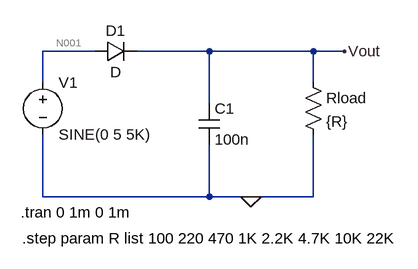
[diagram p0: schematic rectificador de media ona.asc]
rectificador de media ona.asc, the LTspice schematic file:
Version 4
SHEET 1 880 680
WIRE 176 64 96 64
WIRE 352 64 240 64
WIRE 512 64 352 64
WIRE 560 64 512 64
WIRE 96 112 96 64
WIRE 512 112 512 64
WIRE 352 144 352 64
WIRE 96 288 96 192
WIRE 352 288 352 208
WIRE 352 288 96 288
WIRE 416 288 352 288
WIRE 512 288 512 192
WIRE 512 288 416 288
FLAG 416 288 0
FLAG 560 64 Vout
SYMBOL voltage 96 96 R0
WINDOW 123 0 0 Left 0
WINDOW 39 0 0 Left 0
SYMATTR InstName V1
SYMATTR Value SINE(0 5 5K)
SYMBOL diode 176 80 R270
WINDOW 0 32 32 VTop 2
WINDOW 3 0 32 VBottom 2
SYMATTR InstName D1
SYMBOL cap 336 144 R0
SYMATTR InstName C1
SYMATTR Value 100n
SYMBOL res 496 96 R0
SYMATTR InstName Rload
SYMATTR Value {R}
TEXT 62 312 Left 2 !.tran 0 1m 0 1m
TEXT 64 352 Left 2 !.step param R list 100 220 470 1K 2.2K 4.7K 10K 22K

The netlist it stands for:
* rectificador de media ona.asc
V1 N001 0 SINE(0 5 5K)
D1 N001 Vout D
C1 Vout 0 100n
Rload Vout 0 {R}
.model D D
.lib standard.dio
.tran 0 1m 0 1m
.step param R list 100 220 470 1K 2.2K 4.7K 10K 22K
.backanno
.end

* Results of the author's LTspice run, read from the files saved beside the schematic
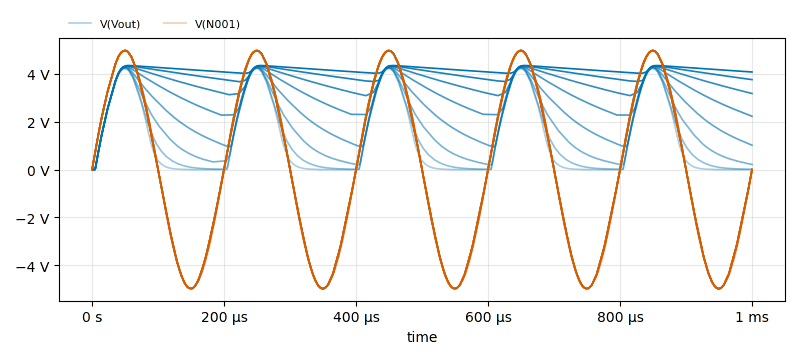
[diagram p1: Transient Analysis of rectificador de media ona.asc, plotted from the saved traces]
* Transient Analysis, 8 runs:
*   V(Vout) [r=100]: min 0 V, max 4.226 V, average 1.257 V, rms 2.014 V, last 14.58 µV
*   V(Vout) [r=220]: min 0 V, max 4.254 V, average 1.399 V, rms 2.068 V, last 9.476 mV
*   V(Vout) [r=470]: min 0 V, max 4.273 V, average 1.789 V, rms 2.256 V, last 214.1 mV
*   V(Vout) [r=1000]: min 0 V, max 4.291 V, average 2.423 V, rms 2.657 V, last 1.02 V
*   V(Vout) [r=2200]: min 0 V, max 4.311 V, average 3.137 V, rms 3.225 V, last 2.231 V
*   V(Vout) [r=4700]: min 0 V, max 4.333 V, average 3.633 V, rms 3.678 V, last 3.183 V
*   V(Vout) [r=10000]: min 0 V, max 4.345 V, average 3.935 V, rms 3.969 V, last 3.763 V
*   V(Vout) [r=22000]: min 0 V, max 4.354 V, average 4.108 V, rms 4.141 V, last 4.082 V
*   V(N001) [r=100]: min -4.988 V, max 4.979 V, average -19.38 mV, rms 3.506 V, last 0 V
*   V(N001) [r=220]: min -4.985 V, max 4.986 V, average 535.7 µV, rms 3.495 V, last 0 V
*   V(N001) [r=470]: min -4.984 V, max 4.986 V, average 21.8 mV, rms 3.508 V, last 0 V
*   V(N001) [r=1000]: min -4.988 V, max 4.985 V, average 20.11 mV, rms 3.517 V, last 0 V
*   V(N001) [r=2200]: min -4.988 V, max 4.988 V, average 12.08 mV, rms 3.536 V, last 0 V
*   V(N001) [r=4700]: min -4.985 V, max 4.987 V, average 1.984 mV, rms 3.529 V, last 0 V
*   V(N001) [r=10000]: min -4.986 V, max 4.983 V, average 1.12 mV, rms 3.53 V, last 0 V
*   V(N001) [r=22000]: min -4.984 V, max 4.984 V, average 601.8 µV, rms 3.525 V, last 0 V